# EAGLE schematic schematic 1 (EAGLE 9.6.2)
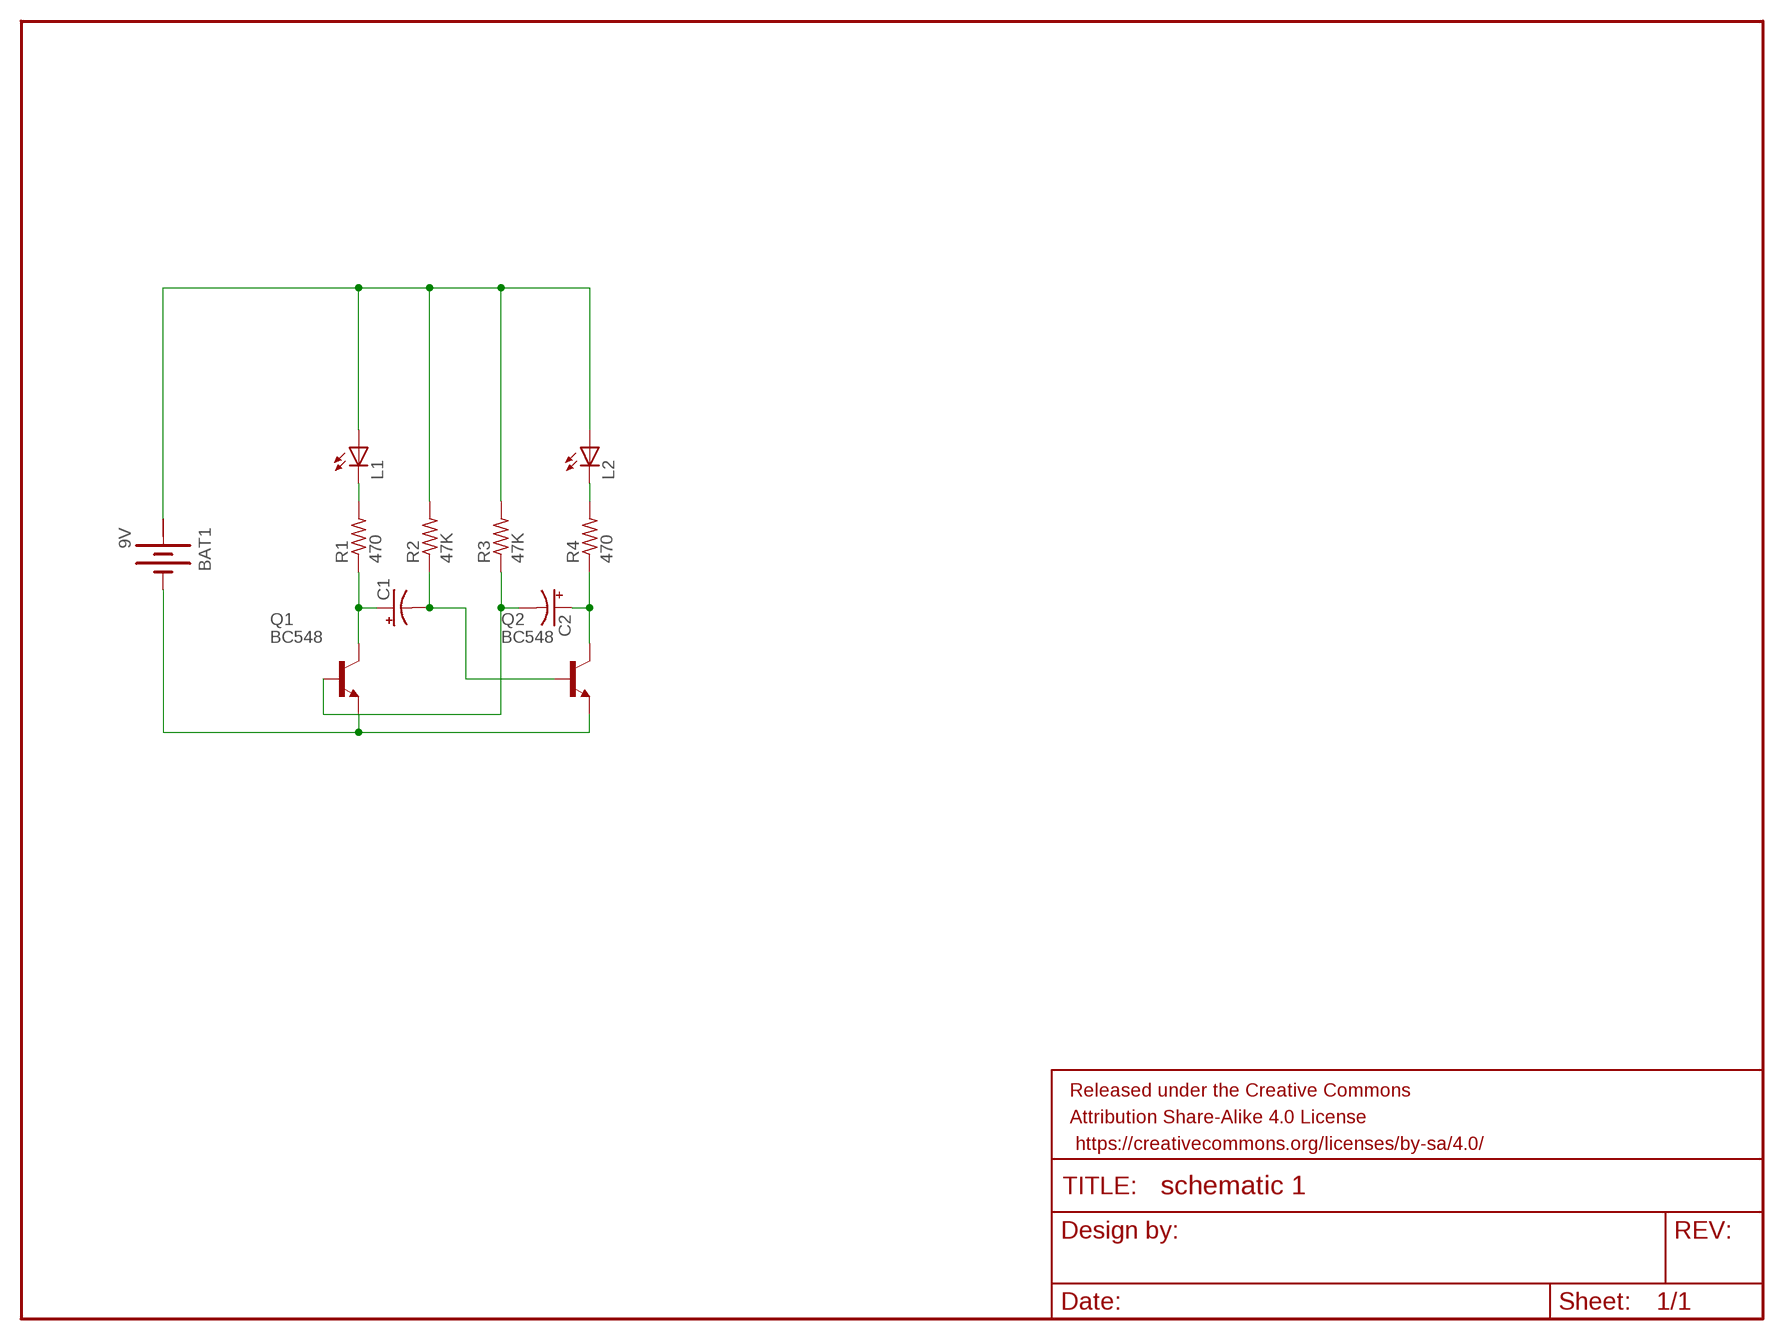
[diagram p0: schematic, sheet 1]

## Parts
BAT1  9V  BATTERY  [BATTERY]
C1  CPOL-USE10-35  [EB35D]
C2  CPOL-USE10-35  [EB35D]
FRAME1  FRAME-LETTER  [CREATIVE_COMMONS]
L1  LEDLZR181  [LZR181]
L2  LEDLZR181  [LZR181]
Q1  BC548  [TO92-EBC]
Q2  BC548  [TO92-EBC]
R1  470  R-US_M2012  [M2012]
R2  47K  R-US_M2012  [M2012]
R3  47K  R-US_M2012  [M2012]
R4  470  R-US_M2012  [M2012]

## Nets
N$1: BAT1.+ L1.A L2.A R2.2 R3.2
N$2: L1.K(C) R1.2
N$3: L2.K(C) R4.2
N$4: C1.+ Q1.C R1.1
N$5: C1.- Q2.B R2.1
N$6: C2.- Q1.B R3.1
N$7: C2.+ Q2.C R4.1
N$8: BAT1.- Q1.E Q2.E

## Power pins joined to a net without a drawn wire
+: BAT1.+@1(+)

## Library data of the parts
BAT1 = special:BATTERY: BATTERY
C1 C2 = adafruit:CPOL-US: POLARIZED CAPACITOR, American symbol
FRAME1 = SparkFun-Aesthetics:FRAME-LETTER: Schematic Frame - Letter Standard 8.5x11 US Letter frame
L1 L2 = adafruit:LED: LED OSRAM: - CHIPLED LG R971, LG N971, LY N971, LG Q971, LY Q971, LO R971, LY R971 LH N974, LH R974 LS Q976, LO Q976, LY Q976 LO Q996 - Hyper CHIPLED LW Q18S LB Q993, LB Q99A, LB R99A - SideLED LS A670, LO A670, LY A670, LG A670, LP A670 LB A673, LV A673, LT A673, LW A673 LH A674 LY A675 LS A676, LA A676, LO A676, LY A676, LW A676 LS A679, LY A679, LG A679 - Hyper Micro SIDELED® LS Y876, LA Y876, LO Y876, LY Y876 LT Y87S - SmartLED LW L88C, LW L88S LB L89C, LB L89S, LG L890 LS L89K, LO L89K, LY L89K LS L896, LA L896, LO L896, LY L896 - TOPLED LS T670, LO T670, LY T670, LG T670, LP T670 LSG T670, LSP T670, LSY T670, LOP T670, LYG T670 LG T671, LOG T671, LSG T671 LB T673, LV T673, LT T673, LW T673 LH T674 LS T676, LA T676, LO T676, LY T676, LB T676, LH T676, LSB T676, LW T676 LB T67C, LV T67C, LT T67C, LS T67K, LO T67K, LY T67K, LW E67C LS E67B, LA E67B, LO E67B, LY E67B, LB E67C, LV E67C, LT E67C LW T67C LS T679, LY T679, LG T679 LS T770, LO T770, LY T770, LG T770, LP T770 LB T773, LV T773, LT T773, LW T773 LH T774 LS E675, LA E675, LY E675, LS T675 LS T776, LA T776, LO T776, LY T776, LB T776 LHGB T686 LT T68C, LB T68C - Hyper Mini TOPLED® LB M676 - Mini TOPLED Santana® LG M470 LS M47K, LO M47K, LY M47K Source: http://www.osram.convergy.de/
Q1 Q2 = transistor-npn:BC548*: NPN Transistor
R1-R4 = adafruit:R-US_: RESISTOR, American symbol